# Altium schematic sheet DriverBoard_Bridge.SchDoc: Плата драйвера
size 420 x 297 mm; ApprovedBy: Иванов; CheckedBy: Вакулин; DrawnBy: Подлесный; DocumentNumber: РД.00.00.01 Э3; SheetNumber: 1; SheetTotal: количество листов; DocumentType: Схема электрическая принципиальная; Format: A3; ImagePath: Введите номер платы
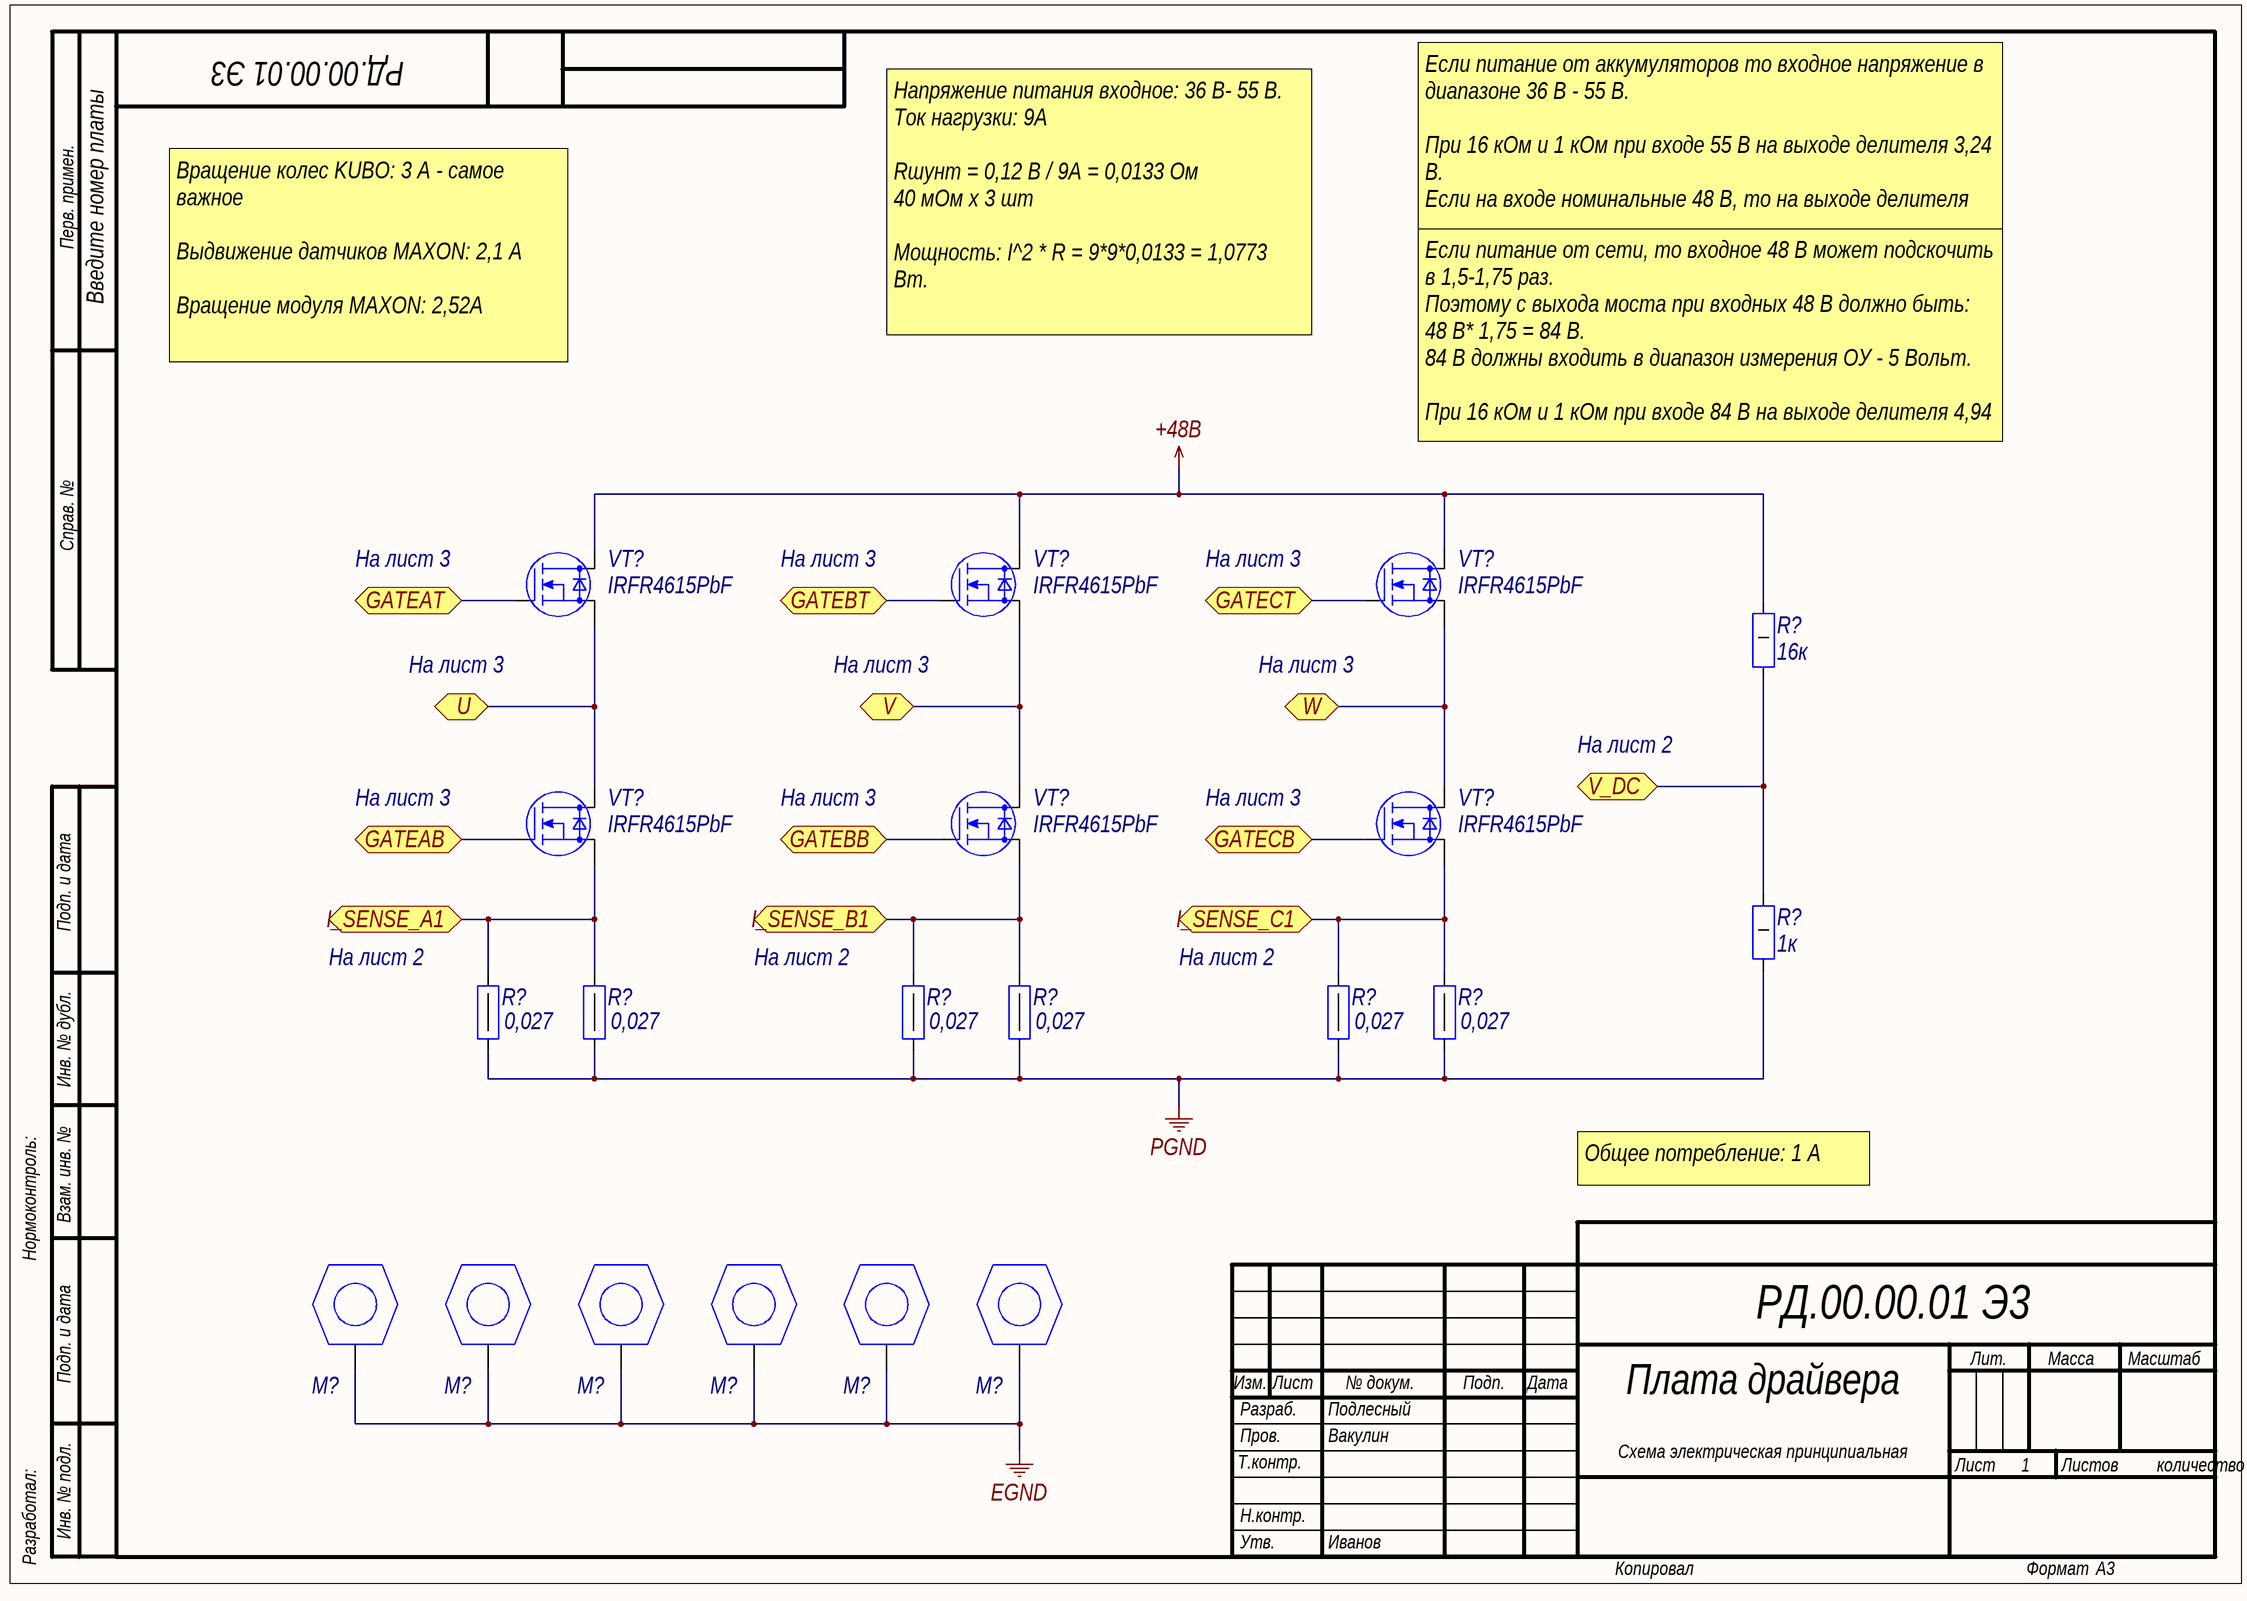
[diagram p0: DriverBoard_Bridge.SchDoc]

## Parts
(Parts that share a designator on the sheet are numbered #1, #2 ... from top to bottom, then left to right.)
M?#1  SCREW  [SCREW3]  (value not drawn)
M?#2  SCREW  [SCREW3]  (value not drawn)
M?#3  SCREW  [SCREW3]  (value not drawn)
M?#4  SCREW  [SCREW3]  (value not drawn)
M?#5  SCREW  [SCREW3]  (value not drawn)
M?#6  SCREW  [SCREW3]  (value not drawn)
R?#1  value 16к  [R2512]  (hidden comment: Resistor_1Вт)
R?#2  value 1к  [R2512]  (hidden comment: Resistor_1Вт)
R?#3  value 0,027  [R2010]  (hidden comment: Resistor_0,5Вт)
R?#4  value 0,027  [R2010]  (hidden comment: Resistor_0,5Вт)
R?#5  value 0,027  [R2010]  (hidden comment: Resistor_0,5Вт)
R?#6  value 0,027  [R2010]  (hidden comment: Resistor_0,5Вт)
R?#7  value 0,027  [R2010]  (hidden comment: Resistor_0,5Вт)
R?#8  value 0,027  [R2010]  (hidden comment: Resistor_0,5Вт)
VT?#1  Part Number: IRFR4615PbF  [DPAK]  (hidden comment: N-MOSFET)
VT?#2  Part Number: IRFR4615PbF  [DPAK]  (hidden comment: N-MOSFET)
VT?#3  Part Number: IRFR4615PbF  [DPAK]  (hidden comment: N-MOSFET)
VT?#4  Part Number: IRFR4615PbF  [DPAK]  (hidden comment: N-MOSFET)
VT?#5  Part Number: IRFR4615PbF  [DPAK]  (hidden comment: N-MOSFET)
VT?#6  Part Number: IRFR4615PbF  [DPAK]  (hidden comment: N-MOSFET)

## Ports
GATEAB, GATEAT, GATEBB, GATEBT, GATECB, GATECT, I_SENSE_A1, I_SENSE_B1, I_SENSE_C1, U, V, V_DC, W

## Nets
+48B: R?#1.2 VT?#1.2(D) VT?#2.2(D) VT?#3.2(D)
EGND: M?#1.1 M?#2.1 M?#3.1 M?#4.1 M?#5.1 M?#6.1
PGND: R?#2.1 R?#3.1 R?#4.1 R?#5.1 R?#6.1 R?#7.1 R?#8.1
GATEAB: VT?#4.1(G) ; port GATEAB
GATEAT: VT?#1.1(G) ; port GATEAT
GATEBB: VT?#5.1(G) ; port GATEBB
GATEBT: VT?#2.1(G) ; port GATEBT
GATECB: VT?#6.1(G) ; port GATECB
GATECT: VT?#3.1(G) ; port GATECT
I_SENSE_A1: R?#3.2 R?#4.2 VT?#4.3(S) ; port I_SENSE_A1
I_SENSE_B1: R?#5.2 R?#6.2 VT?#5.3(S) ; port I_SENSE_B1
I_SENSE_C1: R?#7.2 R?#8.2 VT?#6.3(S) ; port I_SENSE_C1
U: VT?#1.3(S) VT?#4.2(D) ; port U
V: VT?#2.3(S) VT?#5.2(D) ; port V
V_DC: R?#1.1 R?#2.2 ; port V_DC
W: VT?#3.3(S) VT?#6.2(D) ; port W

## Notes on the sheet
- Перв. примен.
- Если питание от аккумуляторов то входное напряжение в диапазоне 36 В - 55 B.
  При 16 кОм и 1 кОм при входе 55 В на выходе делителя 3,24 В.
  Если на входе номинальные 48 В, то на выходе делителя 2,82 В.
  Если на входе 36 В, то на выходе делителя 2,12 В.
- Напряжение питания входное: 36 B- 55 В.
  Ток нагрузки: 9А
  Rшунт = 0,12 B / 9A = 0,0133 Ом
  40 мОм х 3 шт
  Мощность: I^2 * R = 9*9*0,0133 = 1,0773 Вт.
- Вращение колес KUBO: 3 А - самое важное
  Выдвижение датчиков MAXON: 2,1 А
  Вращение модуля MAXON: 2,52А
  Выдвижение УЗ датчика MAXON: 0,748А
- Если питание от сети, то входное 48 В может подскочить в 1,5-1,75 раз.
  Поэтому с выхода моста при входных 48 В должно быть:
  48 В* 1,75 = 84 В.
  84 В должны входить в диапазон измерения ОУ - 5 Вольт.
  При 16 кОм и 1 кОм при входе 84 В на выходе делителя 4,94 В.
- Справ. №
- На лист 3
- (near VT?#1) На лист 3
- (near VT?#2) На лист 3
- (near VT?#3) На лист 3
- На лист 2
- Подп. и дата
- (near R?#3) На лист 2
- (near R?#5) На лист 2
- (near R?#7) На лист 2
- Инв. № дубл.
- Нормоконтроль:
- Взам. инв. №
- Общее потребление: 1 A
- Изм.
- Лист
- № докум.
- Подп.
- Дата
- Лит.
- Масса
- Масштаб
- Т.контр.
- Пров.
- Разраб.
- Листов
- Разработал:
- Инв. № подл.
- Н.контр.
- Утв.
- Копировал
- Формат

## Library data of the parts
M?#1-M?#6 = connect89: Part Name: Винт М3 с заземлением; id: connect89
R?#1 = res879: Резистор; Manufacture: Yageo; Part Number: RC2512FR-0716KL; id: res879; Accuracy: 0,01; Power: 1Вт; Part Name: Resistor
R?#2 = res850: Резистор; Manufacture: Yageo; Part Number: RC2512FR-071KL; id: res850; Accuracy: 0,01; Power: 1Вт; Part Name: Resistor
R?#3-R?#8 = res1151: Резистор; Part Name: Shunt; Manufacture: Yageo; Part Number: RL2010FK-070R027L; Accuracy: 0,01; Power: 0,75Вт; id: res1151
VT?#1-VT?#6 = mosfert20: Manufacturer: International Rectifier; Structure: n-channel; V drain-source max: 150B; Rds: 0,042Ohm; Gate-to-source voltage: (+-)20B; Continuous drain current: 33A; Total gate charge: 26nC; Pulsed drain current: 140A; Power dissipation: 144W; id: mosfert20